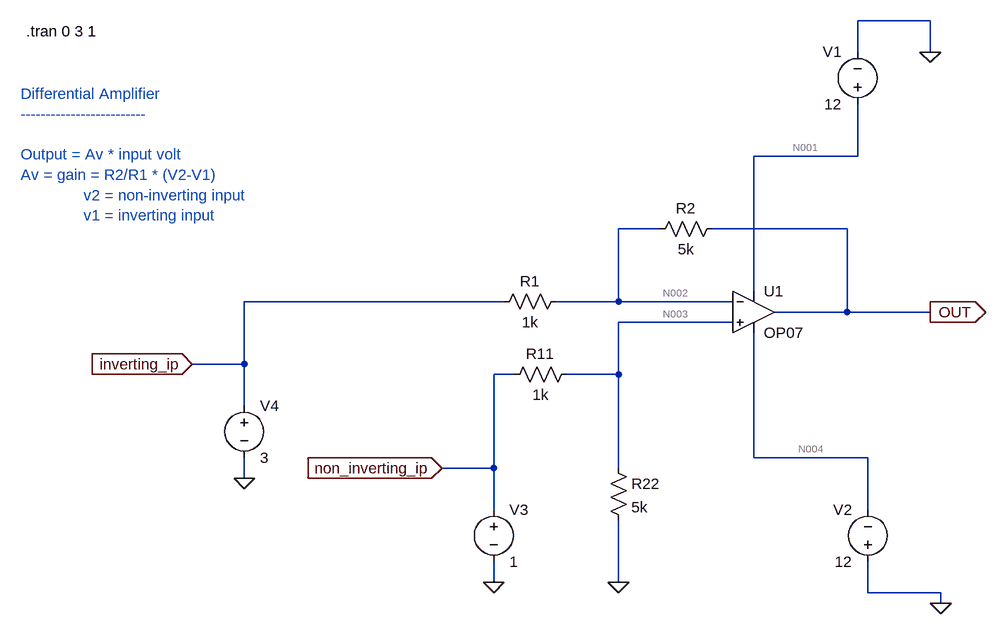
[diagram p0: schematic opAmp_as_SUBTRACTOR_with_DC_input .asc]
opAmp_as_SUBTRACTOR_with_DC_input .asc, the LTspice schematic file:
Version 4.1
SHEET 1 2948 724
WIRE 352 -368 240 -368
WIRE 240 -320 240 -368
WIRE 352 -320 352 -368
WIRE 240 -160 240 -240
WIRE 240 -160 80 -160
WIRE -64 -48 -128 -48
WIRE 224 -48 16 -48
WIRE 80 48 80 -160
WIRE -304 64 -704 64
WIRE -128 64 -128 -48
WIRE -128 64 -224 64
WIRE 48 64 -128 64
WIRE 224 80 224 -48
WIRE 224 80 112 80
WIRE 352 80 224 80
WIRE 48 96 -128 96
WIRE -704 160 -704 64
WIRE -704 160 -784 160
WIRE -288 176 -320 176
WIRE -128 176 -128 96
WIRE -128 176 -208 176
WIRE -704 224 -704 160
WIRE 80 304 80 112
WIRE 256 304 80 304
WIRE -320 320 -320 176
WIRE -320 320 -400 320
WIRE -128 320 -128 176
WIRE -704 336 -704 304
WIRE -320 384 -320 320
WIRE 256 384 256 304
WIRE -320 496 -320 464
WIRE -128 496 -128 400
WIRE 256 512 256 464
WIRE 368 512 256 512
WIRE 368 528 368 512
FLAG 352 -320 0
FLAG -320 496 0
FLAG 352 80 OUT
IOPIN 352 80 Out
FLAG -400 320 non_inverting_ip
IOPIN -400 320 In
FLAG -704 336 0
FLAG -784 160 inverting_ip
IOPIN -784 160 In
FLAG 368 528 0
FLAG -128 496 0
SYMBOL voltage 240 -224 R180
WINDOW 0 24 96 Left 2
WINDOW 3 24 16 Left 2
WINDOW 123 0 0 Left 0
WINDOW 39 0 0 Left 0
SYMATTR InstName V1
SYMATTR Value 12
SYMBOL voltage 256 480 R180
WINDOW 0 24 96 Left 2
WINDOW 3 24 16 Left 2
WINDOW 123 0 0 Left 0
WINDOW 39 0 0 Left 0
SYMATTR InstName V2
SYMATTR Value 12
SYMBOL OpAmps\\OP07 80 16 R0
SYMATTR InstName U1
SYMBOL res -208 48 R90
WINDOW 0 0 56 VBottom 2
WINDOW 3 32 56 VTop 2
SYMATTR InstName R1
SYMATTR Value 1k
SYMBOL res 32 -64 R90
WINDOW 0 0 56 VBottom 2
WINDOW 3 32 56 VTop 2
SYMATTR InstName R2
SYMATTR Value 5k
SYMBOL voltage -320 368 R0
WINDOW 123 0 0 Left 0
WINDOW 39 0 0 Left 0
SYMATTR InstName V3
SYMATTR Value 1
SYMBOL voltage -704 208 R0
WINDOW 123 0 0 Left 0
WINDOW 39 0 0 Left 0
SYMATTR InstName V4
SYMATTR Value 3
SYMBOL res -192 160 R90
WINDOW 0 0 56 VBottom 2
WINDOW 3 32 56 VTop 2
SYMATTR InstName R11
SYMATTR Value 1k
SYMBOL res -144 304 R0
SYMATTR InstName R22
SYMATTR Value 5k
TEXT -1040 -352 Left 2 !.tran 0 3 1
TEXT -1048 -256 Left 2 ;Differential Amplifier\n-------------------------\n \nOutput = Av * input volt\nAv = gain = R2/R1 * (V2-V1)\n              v2 = non-inverting input\n              v1 = inverting input

The netlist it stands for:
* opAmp_as_SUBTRACTOR_with_DC_input .asc
V1 N001 0 12
V2 0 N004 12
X§U1 N003 N002 N001 N004 OUT LT1001  ; OP07, pins In+ In- V+ V- OUT
R1 N002 inverting_ip 1k
R2 OUT N002 5k
V3 non_inverting_ip 0 1
V4 inverting_ip 0 3
R11 N003 non_inverting_ip 1k
R22 N003 0 5k
.tran 0 3 1
* Differential Amplifier
* -------------------------
* Output = Av * input volt
* Av = gain = R2/R1 * (V2-V1)
*               v2 = non-inverting input
*               v1 = inverting input
.lib LTC.lib
.backanno
.end

* Results of the author's LTspice run, read from the files saved beside the schematic
* Operating Point, zero values left out:
*   V(n004) = -12 V
*   V(n002) = 833.3 mV
*   V(out) = -10 V
*   V(non_inverting_ip) = 1 V
*   V(n001) = 12 V
*   V(n003) = 833.3 mV
*   V(inverting_ip) = 3 V
*   I(V1) = -1.297 mA
*   I(R2) = -2.167 mA
*   I(R11) = -166.7 µA
*   I(V4) = -2.167 mA
*   I(R22) = 166.7 µA
*   I(V2) = -3.464 mA
*   I(R1) = -2.167 mA
*   I(V3) = -166.7 µA
*   Ix(u1:1) = 1.306 pA
*   Ix(u1:2) = 1.67 pA
*   Ix(u1:3) = 1.297 mA
*   Ix(u1:4) = -3.464 mA
*   Ix(u1:5) = 2.167 mA